# Altium schematic sheet ACCELEROMETER.SchDoc
size 420 x 297 mm; SheetNumber: 10; SheetTotal: 19
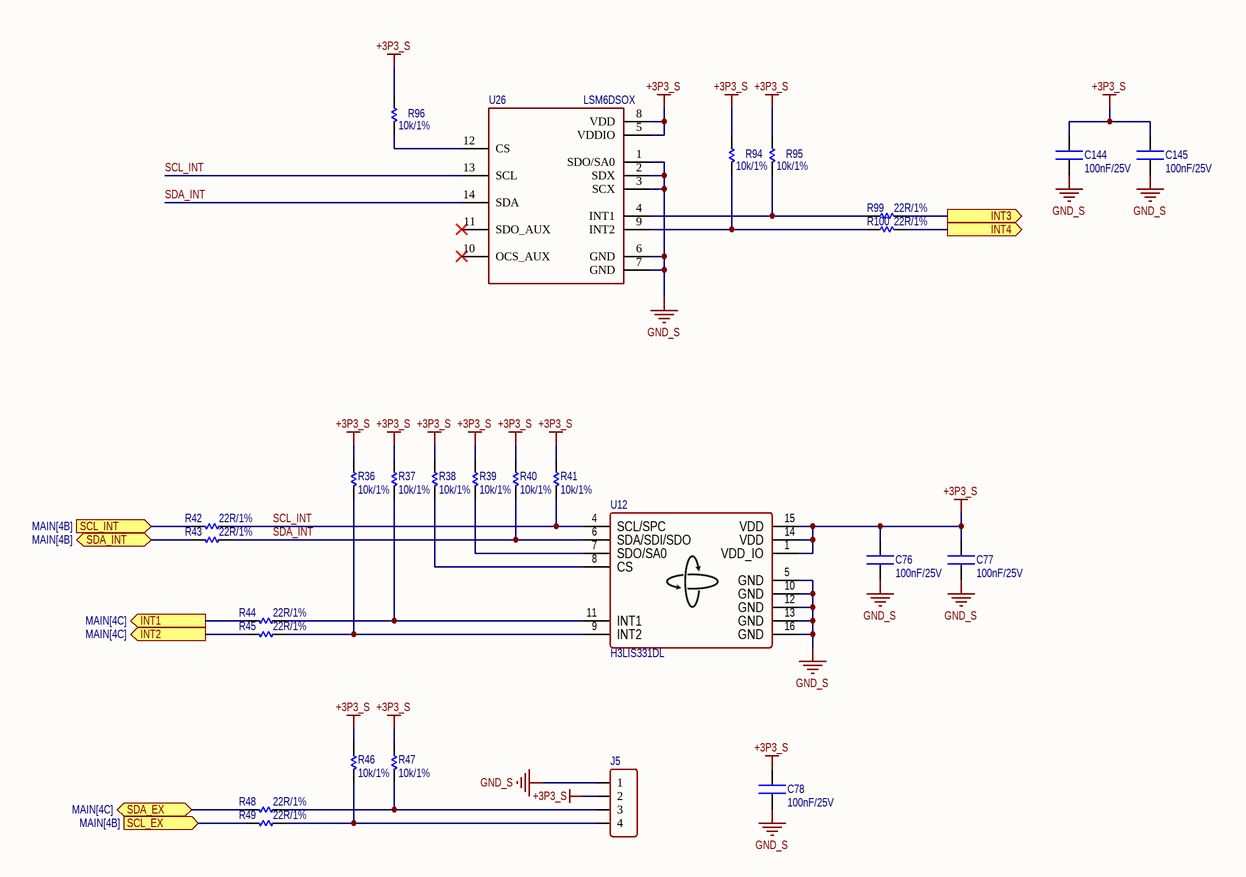
[diagram p0: ACCELEROMETER.SchDoc]

## Parts
C76  100nF/25V  [CN-SMD-0603]
C77  100nF/25V  [CN-SMD-0603]
C78  100nF/25V  [CN-SMD-0603]
C144  100nF/25V  [CN-SMD-0603]
C145  100nF/25V  [CN-SMD-0603]
J5  SM04B-SRSS-TBLFSN  [BM04B-SRSS-TB]  (value not drawn)
R36  10k/1%  [RES-SMD-0603]
R37  10k/1%  [RES-SMD-0603]
R38  10k/1%  [RES-SMD-0603]
R39  10k/1%  [RES-SMD-0603]
R40  10k/1%  [RES-SMD-0603]
R41  10k/1%  [RES-SMD-0603]
R42  22R/1%  [RES-SMD-0603]
R43  22R/1%  [RES-SMD-0603]
R44  22R/1%  [RES-SMD-0603]
R45  22R/1%  [RES-SMD-0603]
R46  10k/1%  [RES-SMD-0603]
R47  10k/1%  [RES-SMD-0603]
R48  22R/1%  [RES-SMD-0603]
R49  22R/1%  [RES-SMD-0603]
R94  10k/1%  [RES-SMD-0603]
R95  10k/1%  [RES-SMD-0603]
R96  10k/1%  [RES-SMD-0603]
R99  22R/1%  [RES-SMD-0603]
R100  22R/1%  [RES-SMD-0603]
U12  H3LIS331DL  [TFLGA-16L]
U26  LSM6DSOX  [LSM6DSOX]

## Ports
INT1 (out, see MAIN[4C]), INT2 (out, see MAIN[4C]), INT3 (out, see MAIN[4C]), INT4 (out, see MAIN[4C]), SCL_EX (in, see MAIN[4B]), SCL_INT (in, see MAIN[4B]), SDA_EX (bidir, see MAIN[4C]), SDA_INT (bidir, see MAIN[4B])

## Nets
+3P3_S: C76.2 C77.2 C78.2 C144.2 C145.2 J5.2 R36.1 R37.1 R38.1 R39.1 R40.1 R41.1 R46.1 R47.1 R94.1 R95.1 R96.1 U12.1(VDD_IO) U12.14(VDD) U12.15(VDD) U26.5(VDDIO) U26.8(VDD)
GND_S: C76.1 C77.1 C78.1 C144.1 C145.1 J5.1 U12.5(GND) U12.10(GND) U12.12(GND) U12.13(GND) U12.16(GND) U26.1(SDO/SA0) U26.2(SDX) U26.3(SCX) U26.6(GND) U26.7(GND)
INT1: R44.2 ; port INT1
INT2: R45.2 ; port INT2
INT3: R99.2 ; port INT3
INT4: R100.2 ; port INT4
SCL_EX: R49.2 ; port SCL_EX
SCL_INT: R41.2 R42.1 U12.4(SCL/SPC) U26.13(SCL)
SCL_INT: R42.2 ; port SCL_INT  [a separate net that carries the same name]
SDA_EX: R48.2 ; port SDA_EX
SDA_INT: R40.2 R43.1 U12.6(SDA/SDI/SDO) U26.14(SDA)
SDA_INT: R43.2 ; port SDA_INT  [a separate net that carries the same name]
NetJ5_3: J5.3 R47.2 R48.1
NetJ5_4: J5.4 R46.2 R49.1
NetR36_2: R36.2 R45.1 U12.9(INT2)
NetR37_2: R37.2 R44.1 U12.11(INT1)
NetR38_2: R38.2 U12.8(CS)
NetR39_2: R39.2 U12.7(SDO/SA0)
NetR94_2: R94.2 R100.1 U26.9(INT2)
NetR95_2: R95.2 R99.1 U26.4(INT1)
NetR96_2: R96.2 U26.12(CS)

Not connected (* = marked no-connect by the designer): U26 10(OCS_AUX)* 11(SDO_AUX)*

## Notes on the sheet
- Project:
- Sub-system:
- Design by:
- Sheet title:
- Sheet
- of
- Checked by:
- Approved by:
- Document No:
- Revision:
- Size:
- Date:

## Library data of the parts
C76-C78 C144 C145 = CN: CAP CER 0.1UF 25V X7R 0603; PN: CL10B104KA8NNNC
J5 = Header4: CONN HEADER SMD R/A 4POS 1MM; ComponentLink1 Description: Manufacturer; ComponentLink2 Description: Datasheet; ComponentLink1URL: http://www.we-online.com; ComponentLink2URL: http://katalog.we-online.de/em/datasheet/6130xx143121.pdf; PN: SM04B-SRSS-TB
R36-R41 R46 R47 = Res-SMD: RES SMD 10K OHM 1% 1/10W 0603; Manufacturer: Generic Components; PN: ERJ-3EKF1002V; Class: Passive; Publisher: Altium Hobart Technology Centre
R42-R45 R48 R49 R99 R100 = Res-SMD: RES SMD 22 OHM 1% 1/10W 0603; PN: ERJ-3EKF22R0V
R94-R96 = Res-SMD: RES SMD 10K OHM 1% 1/10W 0603; PN: ERJ-3EKF1002V
U12 = H3LIS331DL: ACCEL 100-400G I2C/SPI 16TFLGA; PN: H3LIS331DLTR
U26 = LSM6DSOX: INEMO INERTIAL MODULE: 3D ACCELE; MF: STMicroelectronics; PN: LSM6DSOXTR; SnapEDA_Link: https://www.snapeda.com/parts/LSM6DSOX/STMicroelectronics/view-part/?ref=snap; Package: VFLGA-14 STMicroelectronics; Value: *; MP: LSM6DSOX; Check_prices: https://www.snapeda.com/parts/LSM6DSOX/STMicroelectronics/view-part/?ref=eda